# Altium schematic sheet RS232_MAX3223.SchDoc
size A3
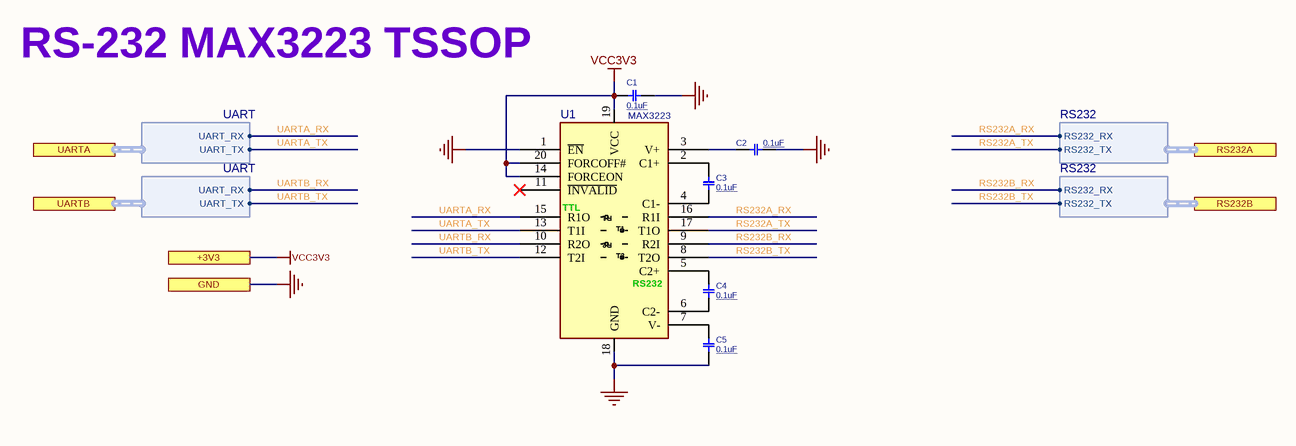
[diagram p0: RS232_MAX3223.SchDoc]

## Parts
C1  0.1uF  [C0402]
C2  0.1uF  [C0402]
C3  0.1uF  [C0402]
C4  0.1uF  [C0402]
C5  0.1uF  [C0402]
U1  MAX3223  [SOG65_20_W]

## Ports
+3V3, GND, RS232A (harness RS232), RS232B (harness RS232), UARTA (harness UART), UARTB (harness UART)

## Harnesses
RS232: RS232_RX, RS232_TX
UART: UART_RX, UART_TX

## Nets
GND: C1.1 C2.2 C5.2 U1.1(~{EN}) U1.18(GND) ; port GND
VCC3V3: C1.2 U1.14(FORCEON) U1.19(VCC) U1.20(FORCOFF#) ; port +3V3
RS232A_RX: U1.16(R1I) ; port RS232A.RS232_RX
RS232A_TX: U1.17(T1O) ; port RS232A.RS232_TX
RS232B_RX: U1.9(R2I) ; port RS232B.RS232_RX
RS232B_TX: U1.8(T2O) ; port RS232B.RS232_TX
UARTA_RX: U1.15(R1O) ; port UARTA.UART_RX
UARTA_TX: U1.13(T1I) ; port UARTA.UART_TX
UARTB_RX: U1.10(R2O) ; port UARTB.UART_RX
UARTB_TX: U1.12(T2I) ; port UARTB.UART_TX
NetC2_1: C2.1 U1.3(V+)
NetC3_1: C3.1 U1.2(C1+)
NetC3_2: C3.2 U1.4(C1-)
NetC4_1: C4.1 U1.5(C2+)
NetC4_2: C4.2 U1.6(C2-)
NetC5_1: C5.1 U1.7(V-)

Not connected (* = marked no-connect by the designer): U1 11(~{INVALID})*

## Notes on the sheet
- RS-232 MAX3223 TSSOP
- Title
- Size:
- Date:
- A3
- Number:
- Time:
- Revision:
- Sheet
- of
- File:
- (in symbol MAX3223_SSOP20W) TTL; R1; R2; T1; T2; RS232

## Library data of the parts
C1-C5 = CAP_SMD_MLCC_0402: CAP, MLCC; PARAM: -, -%; MANF_P#: MANF_PART#; PARAM2: 50V; PRICE: 100= 1$; MANF: -; ASSEMBLY: ASSEMBLY; VALUE: 0.1uF
U1 = MAX3223_SSOP20W: RS-232, DUAL, +3~5V, Driver/Receiver, Low-Power, up to 1Mbps, Using Four 0.1µF External Capacitor; MANF_PART#: MAX3223ECAP+; MANF: Maxim Integrated; PARAM2: +3~5.5V; PARAM: PARAM; VALUE: MAX3223